# Altium schematic sheet QCopterRC_EXTERN_Sch.SchDoc
size A4
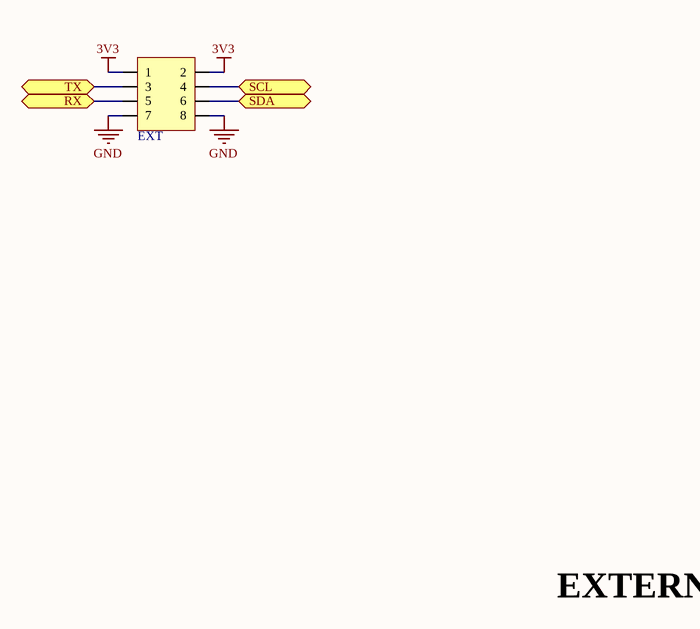
[diagram p0: QCopterRC_EXTERN_Sch.SchDoc]

## Parts
EXT  HDR2X4_90_2.54  [HDR2X4_90_2.54]  (value not drawn)

## Ports
RX, SCL, SDA, TX

## Nets
3V3: EXT.1 EXT.2
GND: EXT.7 EXT.8
RX: EXT.5 ; port RX
SCL: EXT.4 ; port SCL
SDA: EXT.6 ; port SDA
TX: EXT.3 ; port TX

## Notes on the sheet
- Labels drawn without touching a wire or pin: EXTERN

## Library data of the parts
EXT = HDR2X4_90_2.54: Header